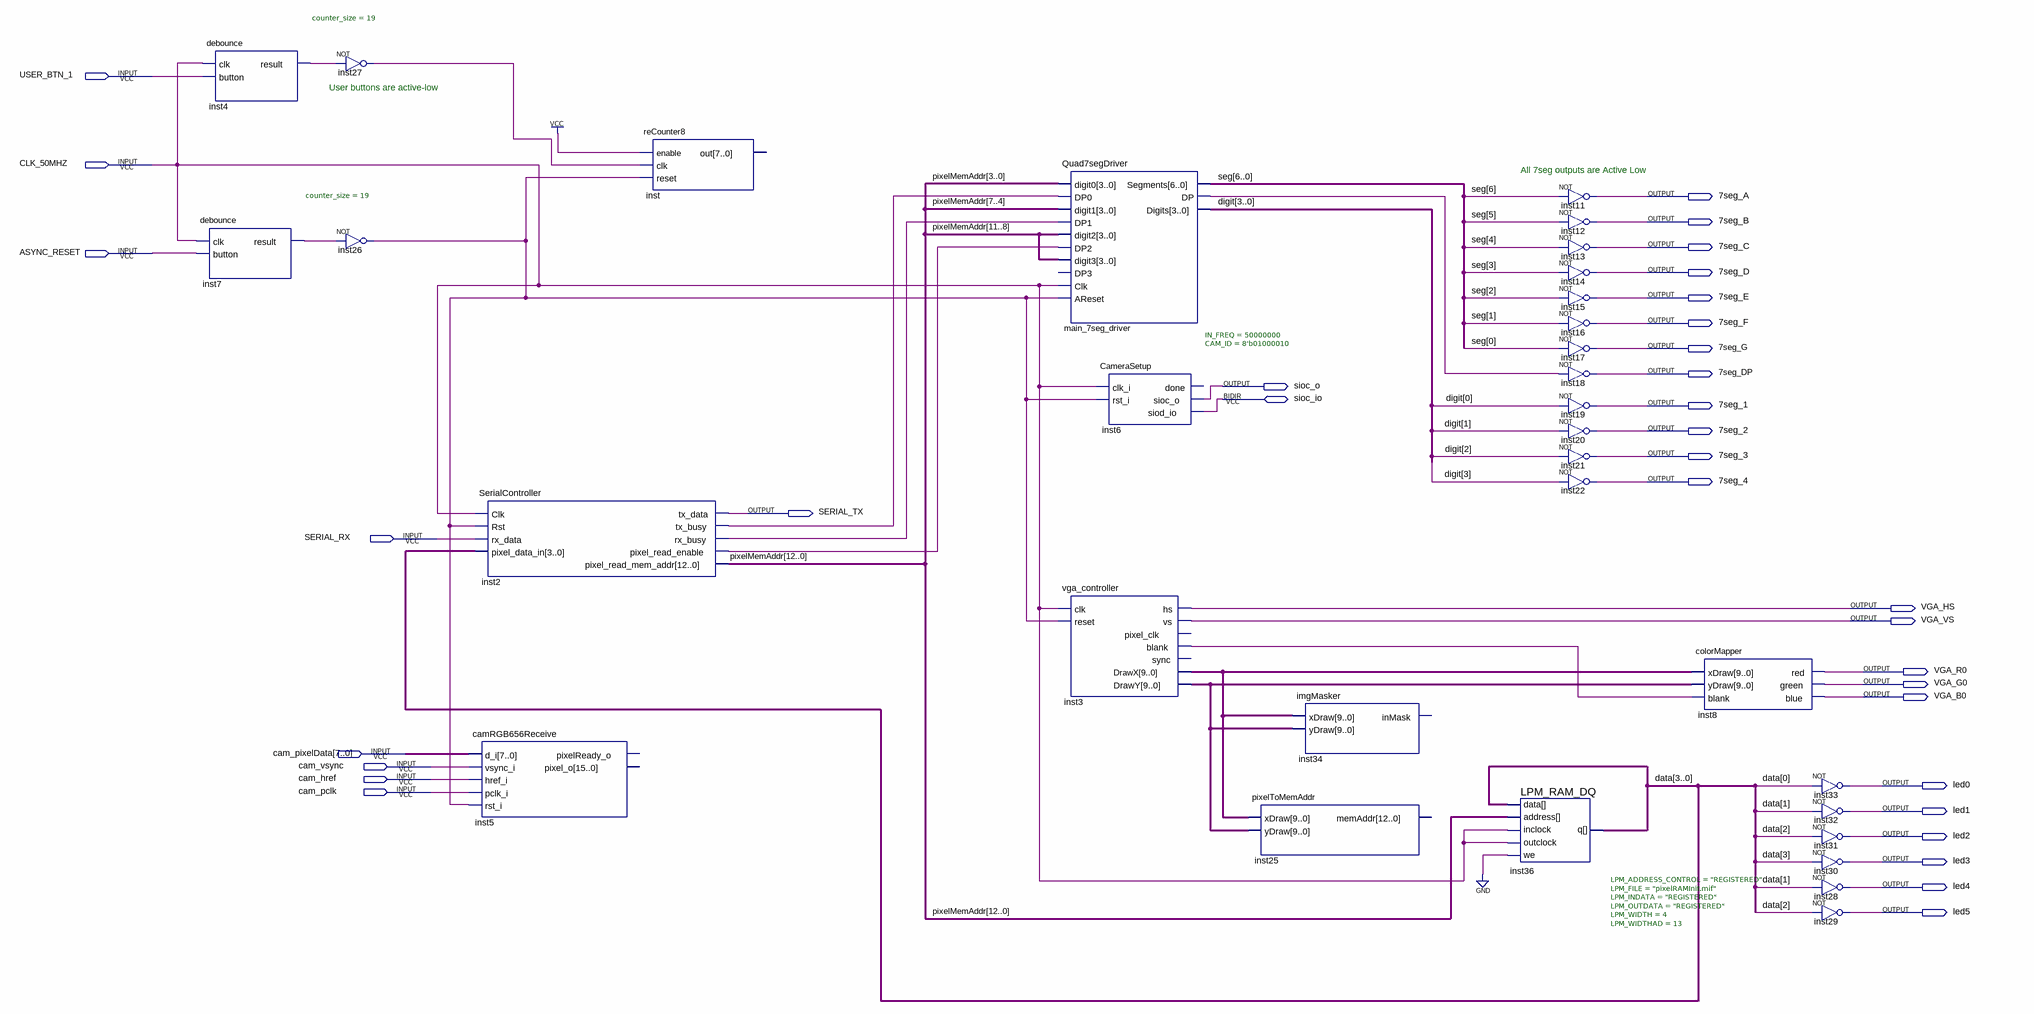
[diagram p0: schematic sheet]
// Quartus schematic TopLevel.bdf as structural Verilog: 32 symbols, 34 pins
module TopLevel (
  input  USER_BTN_1,
  input  CLK_50MHZ,
  input  ASYNC_RESET,
  input  SERIAL_RX,
  input  [7:0] cam_pixelData,
  input  cam_vsync,
  input  cam_href,
  input  cam_pclk,
  inout  sioc_io,
  output \7seg_A ,
  output \7seg_B ,
  output \7seg_C ,
  output \7seg_D ,
  output \7seg_E ,
  output \7seg_F ,
  output \7seg_G ,
  output \7seg_DP ,
  output sioc_o,
  output \7seg_1 ,
  output \7seg_2 ,
  output \7seg_3 ,
  output \7seg_4 ,
  output SERIAL_TX,
  output VGA_HS,
  output VGA_VS,
  output VGA_R0,
  output VGA_G0,
  output VGA_B0,
  output led0,
  output led1,
  output led2,
  output led3,
  output led4,
  output led5
);

  wire inst2_pixel_read_enable, inst2_rx_busy, inst2_tx_busy, inst3_blank, inst4_result, inst7_result,
       inst26_out, inst27_out, main_7seg_driver_dp;
  wire [3:0] data, digit;
  wire [6:0] seg;
  wire [9:0] inst3_drawx, inst3_drawy;
  wire [12:0] pixelMemAddr;

  debounce #(.counter_size(19)) inst4 (.clk(CLK_50MHZ), .button(USER_BTN_1), .result(inst4_result));
  debounce #(.counter_size(19)) inst7 (.clk(CLK_50MHZ), .button(ASYNC_RESET), .result(inst7_result));
  not inst27 (inst27_out, inst4_result);
  not inst26 (inst26_out, inst7_result);
  SerialController inst2 (
    .Clk(CLK_50MHZ), .Rst(inst26_out), .rx_data(SERIAL_RX), .pixel_data_in(data), .tx_data(SERIAL_TX),
    .tx_busy(inst2_tx_busy), .rx_busy(inst2_rx_busy), .pixel_read_enable(inst2_pixel_read_enable),
    .pixel_read_mem_addr(pixelMemAddr));
  camRGB656Receive inst5 (
    .d_i(cam_pixelData), .vsync_i(cam_vsync), .href_i(cam_href), .pclk_i(cam_pclk), .rst_i(inst26_out));  // open: pixelReady_o, pixel_o
  reCounter8 inst (.enable(1'b1), .clk(inst27_out), .reset(inst26_out));  // open: out
  Quad7segDriver main_7seg_driver (
    .digit0(pixelMemAddr[3:0]), .DP0(inst2_tx_busy), .digit1(pixelMemAddr[7:4]), .DP1(inst2_rx_busy),
    .digit2(pixelMemAddr[11:8]), .DP2(inst2_pixel_read_enable), .digit3(pixelMemAddr[11:8]), .Clk(CLK_50MHZ),
    .AReset(inst26_out), .Segments(seg), .DP(main_7seg_driver_dp), .Digits(digit));  // open: DP3
  vga_controller inst3 (
    .clk(CLK_50MHZ), .reset(inst26_out), .hs(VGA_HS), .vs(VGA_VS), .blank(inst3_blank), .DrawX(inst3_drawx),
    .DrawY(inst3_drawy));  // open: pixel_clk, sync
  CameraSetup #(.IN_FREQ(50000000), .CAM_ID(8'b01000010)) inst6 (
    .clk_i(CLK_50MHZ), .rst_i(inst26_out), .sioc_o(sioc_o), .siod_io(sioc_io));  // open: done
  pixelToMemAddr inst25 (.xDraw(inst3_drawx), .yDraw(inst3_drawy));  // open: memAddr
  imgMasker inst34 (.xDraw(inst3_drawx), .yDraw(inst3_drawy));  // open: inMask
  LPM_RAM_DQ #(.LPM_ADDRESS_CONTROL("REGISTERED"), .LPM_FILE("pixelRAMInit.mif"), .LPM_INDATA("REGISTERED"), .LPM_OUTDATA("REGISTERED"), .LPM_WIDTH(4), .LPM_WIDTHAD(13)) inst36 (
    .inclock(CLK_50MHZ), .data(data), .address(pixelMemAddr), .we(1'b0), .outclock(CLK_50MHZ), .q(data));
  not inst11 (\7seg_A , seg[6]);
  not inst12 (\7seg_B , seg[5]);
  not inst13 (\7seg_C , seg[4]);
  not inst14 (\7seg_D , seg[3]);
  not inst15 (\7seg_E , seg[2]);
  not inst16 (\7seg_F , seg[1]);
  not inst17 (\7seg_G , seg[0]);
  not inst18 (\7seg_DP , main_7seg_driver_dp);
  not inst19 (\7seg_1 , digit[0]);
  not inst20 (\7seg_2 , digit[1]);
  not inst21 (\7seg_3 , digit[2]);
  not inst22 (\7seg_4 , digit[3]);
  colorMapper inst8 (
    .xDraw(inst3_drawx), .yDraw(inst3_drawy), .blank(inst3_blank), .red(VGA_R0), .green(VGA_G0), .blue(VGA_B0));
  not inst33 (led0, data[0]);
  not inst32 (led1, data[1]);
  not inst31 (led2, data[2]);
  not inst30 (led3, data[3]);
  not inst28 (led4, data[1]);
  not inst29 (led5, data[2]);

  // Notes on the sheet:
  //   User buttons are active-low
  //   All 7seg outputs are Active Low
endmodule
